# Altium schematic sheet Monitait_V2.SchDoc
size 889 x 508 mm
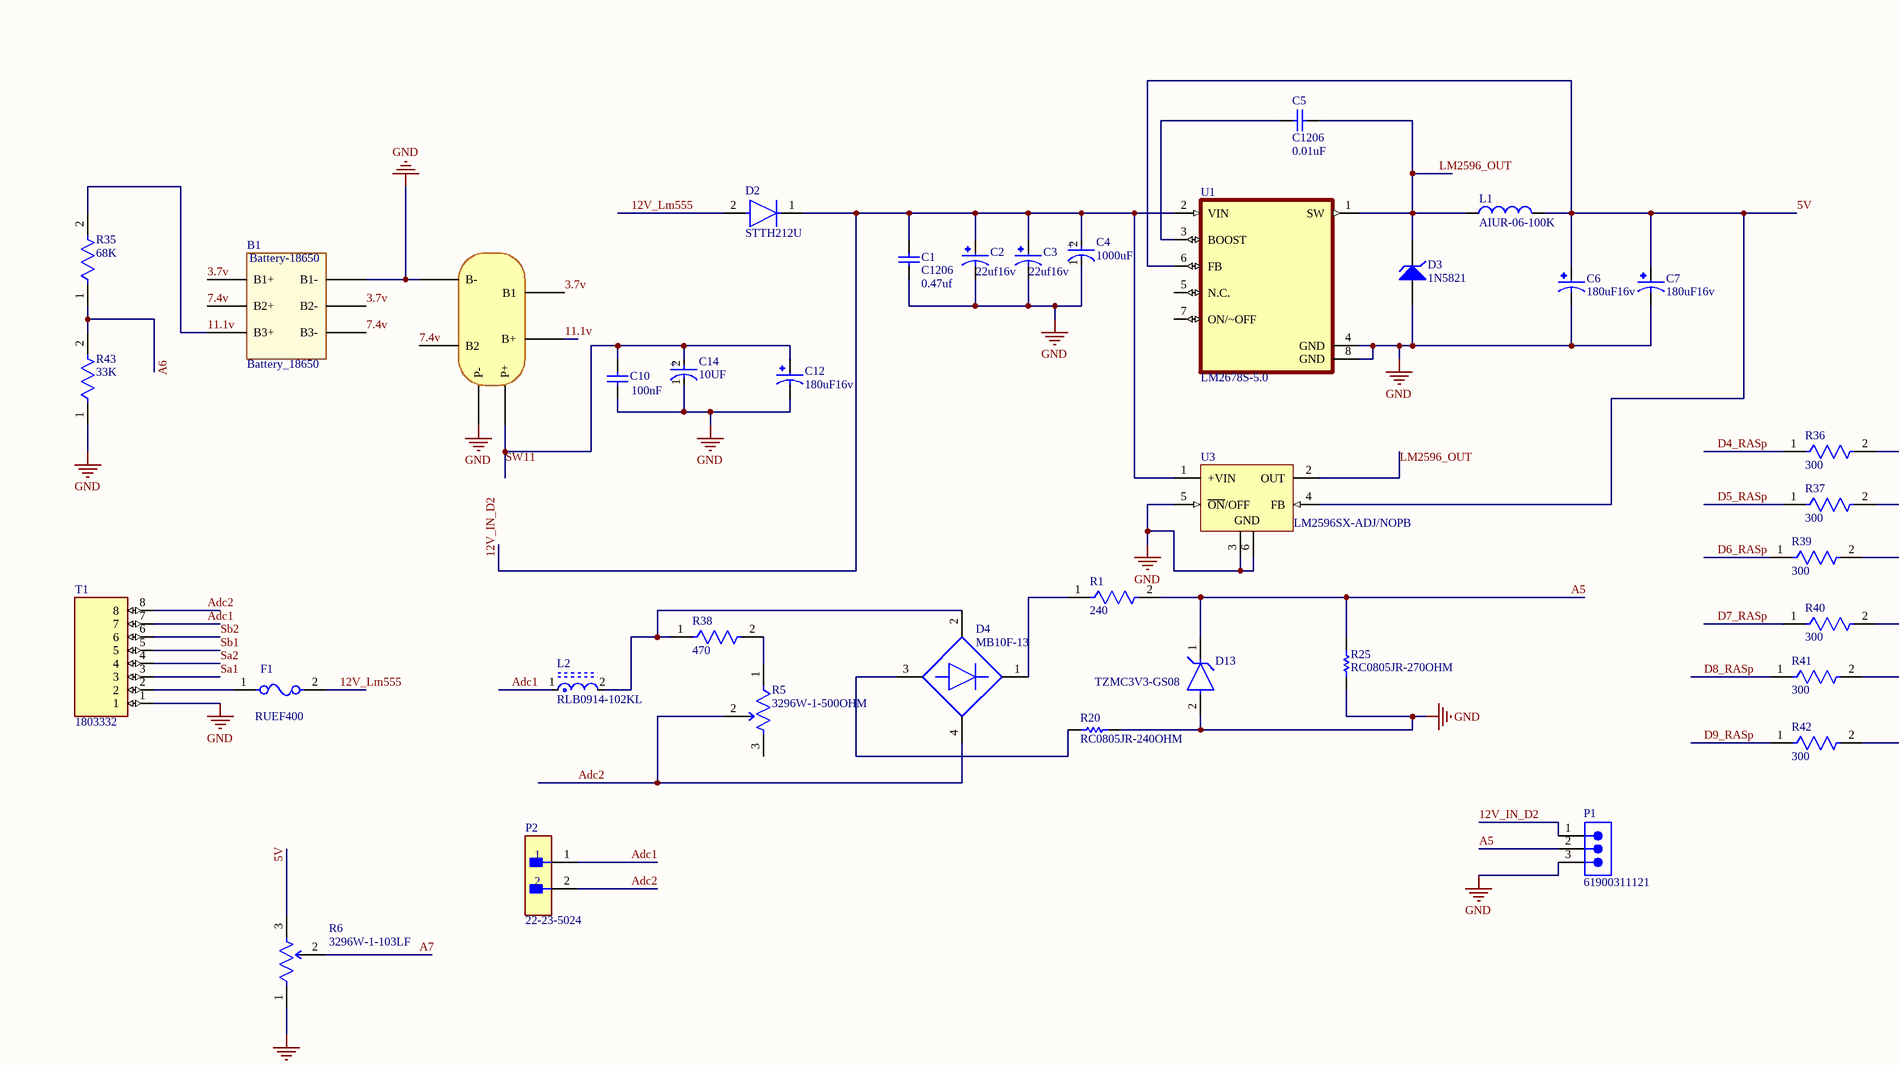
[diagram p0: Monitait_V2.SchDoc, top left]
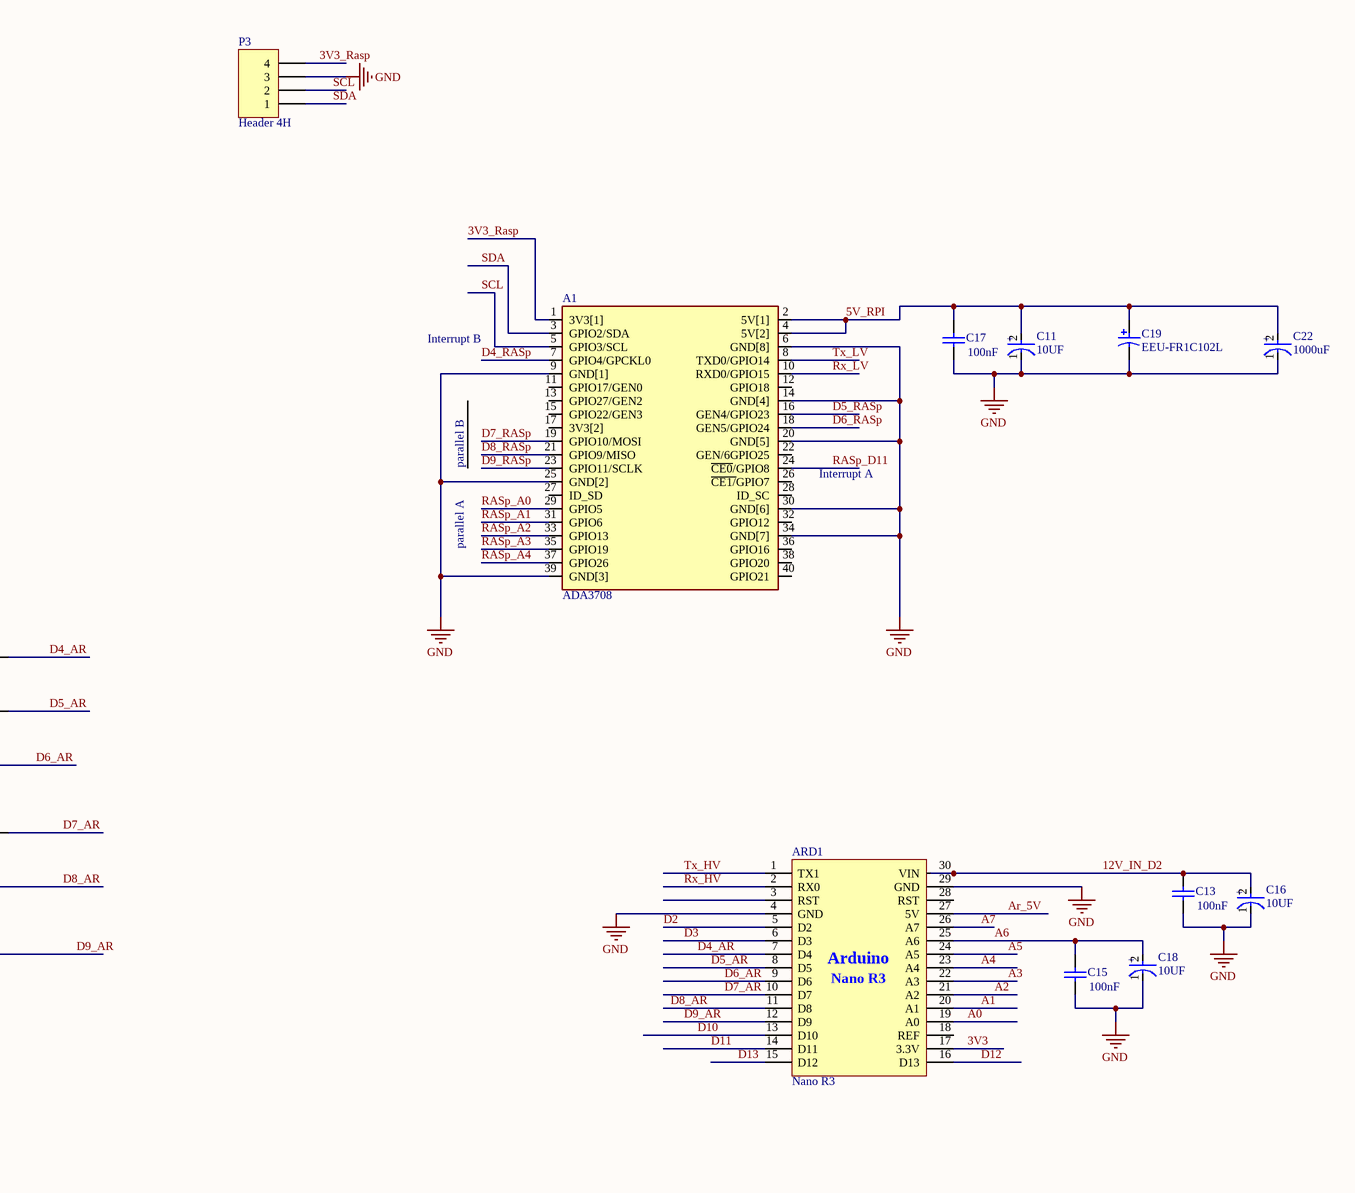
[diagram p1: Monitait_V2.SchDoc, top middle]
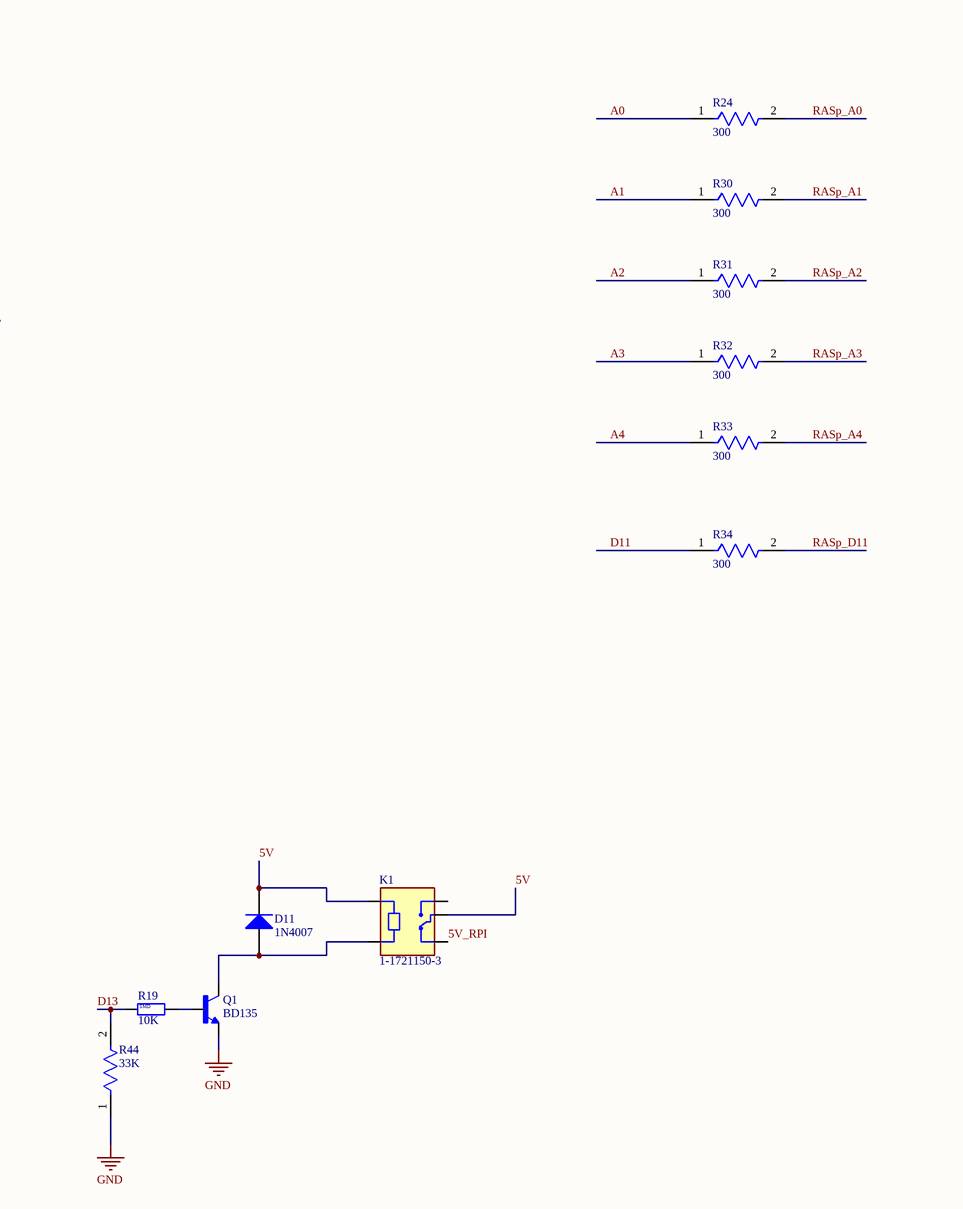
[diagram p2: Monitait_V2.SchDoc, top right]
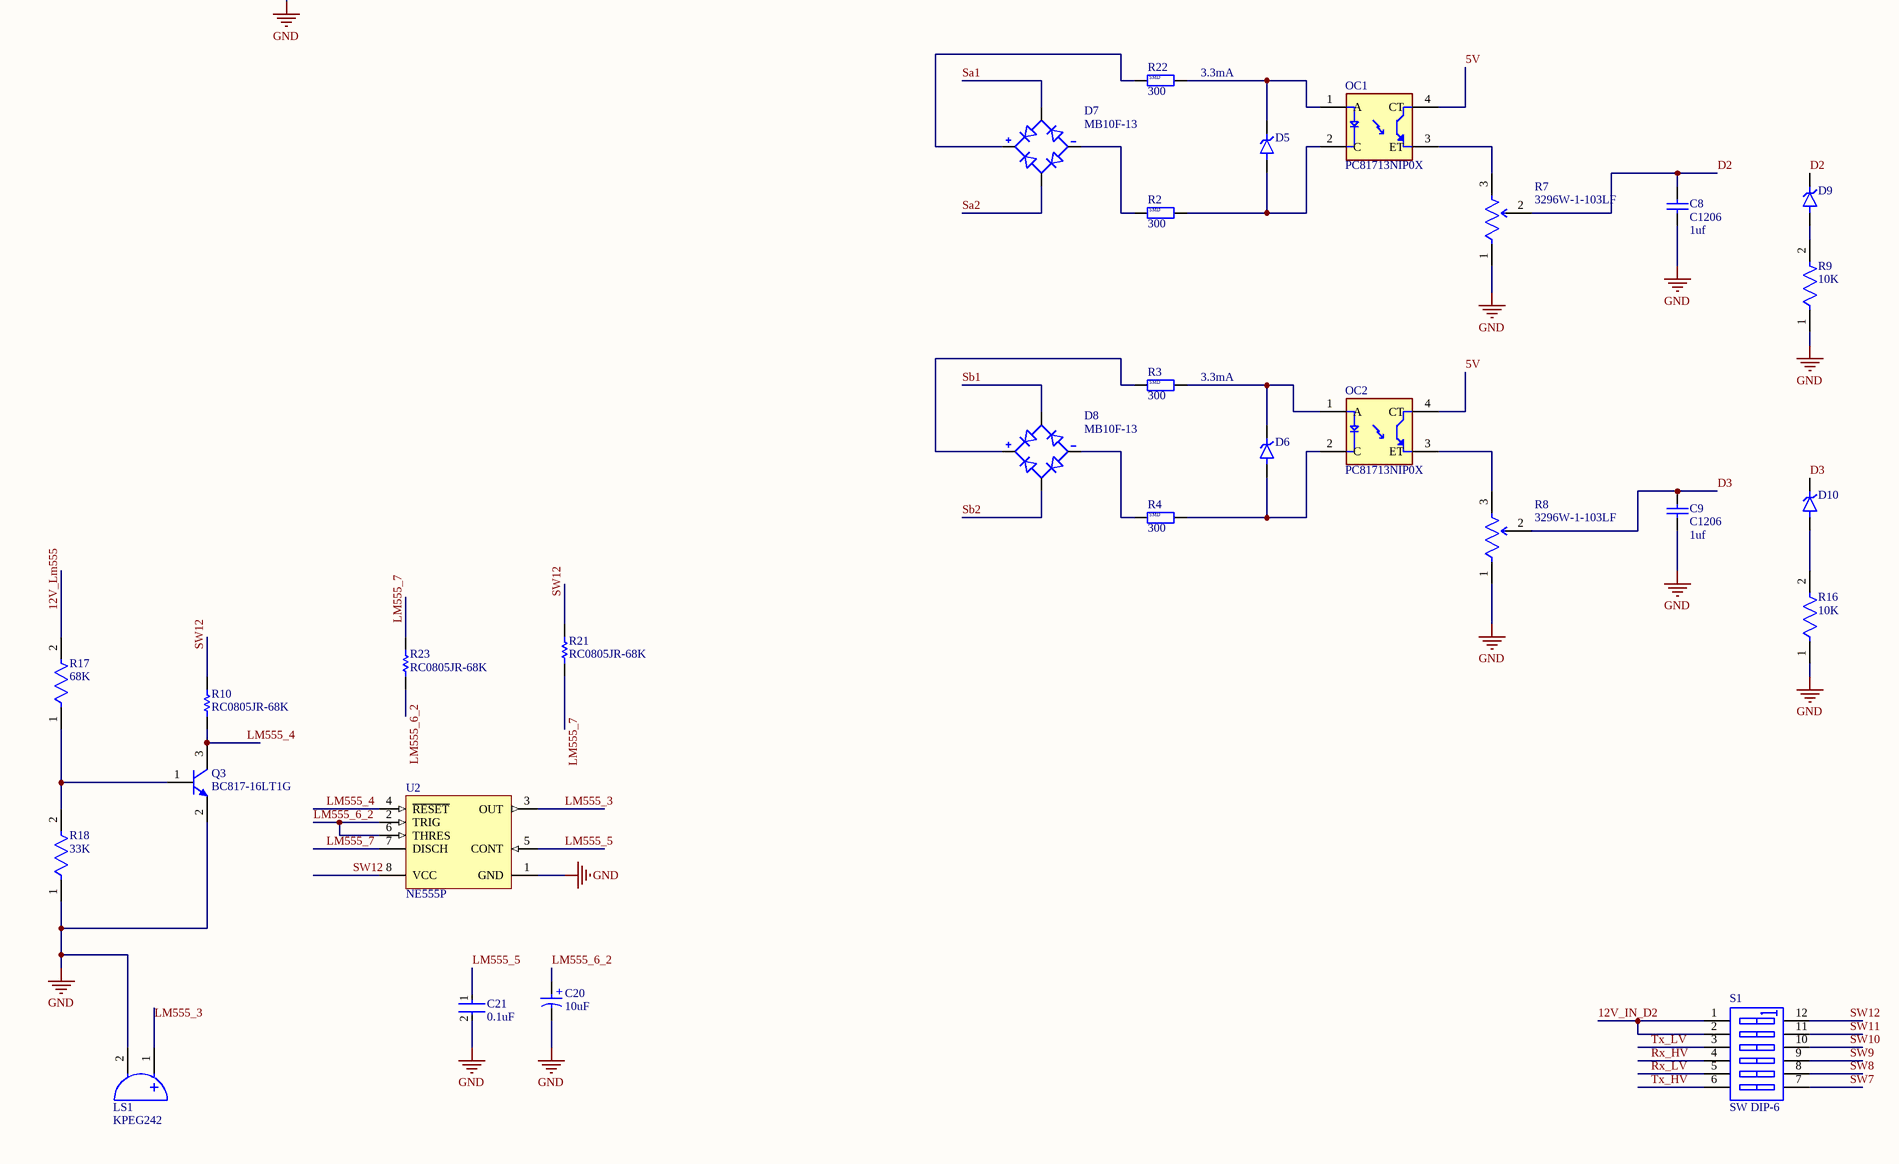
[diagram p3: Monitait_V2.SchDoc, bottom left]
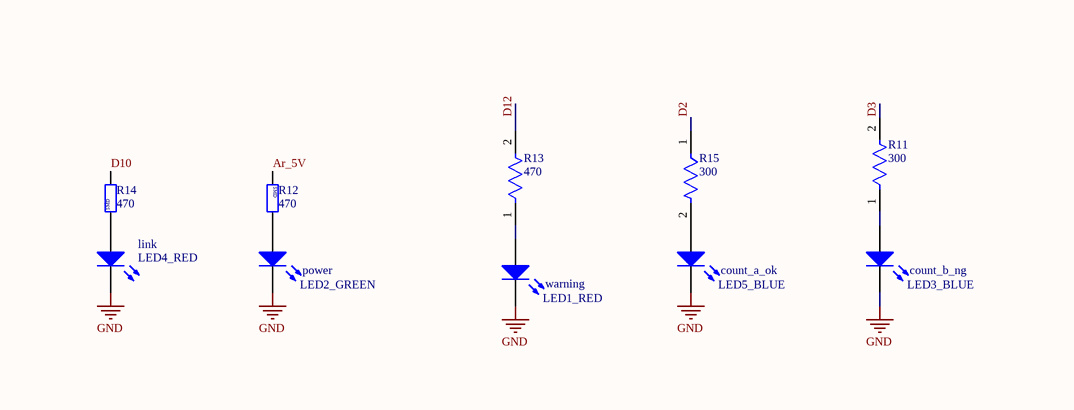
[diagram p4: Monitait_V2.SchDoc, bottom middle]
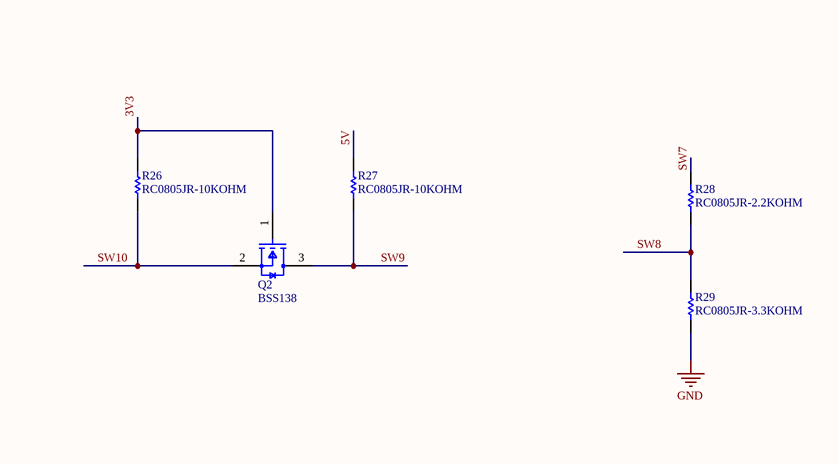
[diagram p5: Monitait_V2.SchDoc, bottom right]

## Parts
A1  ADA3708  [ADA3708_RPI-ZERO]
ARD1  Nano R3  [Arduino_Nano_R3]
B1  Battery_18650  [Battery-18650]
C1  C1206  value 0.47uf  [1206]
C2  22uf16v  [CAPPRD500W45D500H500]
C3  22uf16v  [CAPPRD500W45D500H500]
C4  1000uF  [FP-RAD-TH-D_8_0_5-L_15_1-MFG]
C5  C1206  value 0.01uF  [1206]
C6  180uF16v  [CAPPRD250W50D630H1650]
C7  180uF16v  [CAPPRD250W50D630H1650]
C8  C1206  value 1uf  [1206]
C9  C1206  value 1uf  [1206]
C10  value 100nF  [1206]  (hidden comment: C1206)
C11  10UF  [FP-T491B106K020AT-MFG]
C12  180uF16v  [CAPPRD250W50D630H1650]
C13  value 100nF  [1206]  (hidden comment: C1206)
C14  10UF  [FP-T491B106K020AT-MFG]
C15  value 100nF  [1206]  (hidden comment: C1206)
C16  10UF  [FP-T491B106K020AT-MFG]
C17  value 100nF  [1206]  (hidden comment: C1206)
C18  10UF  [FP-T491B106K020AT-MFG]
C19  EEU-FR1C102L  [PNSC-FR-A-8X20-2_V]
C20  10uF  [WCAP-ATLL_D8H11.5]
C21  0.1uF  [FP-K15H5-MFG]
C22  1000uF  [FP-RAD-TH-D_8_0_5-L_15_1-MFG]
count_a_ok  LED5_BLUE  [LED-3mm]
count_b_ng  LED3_BLUE  [LED-3mm]
D2  STTH212U  [FP-SMB-MFG]
D3  1N5821  [299-02]
D4  MB10F-13  [FP-MBF-MFG]
D5  LLZ5248B  [DIOMELF3515N]  (value not drawn)
D6  LLZ5248B  [DIOMELF3515N]  (value not drawn)
D7  MB10F-13  [DIOB_MB10F-13]
D8  MB10F-13  [DIOB_MB10F-13]
D9  LLZ5248B  [DIOMELF3515N]  (value not drawn)
D10  LLZ5248B  [DIOMELF3515N]  (value not drawn)
D11  1N4007  [My_DO-41]
D13  TZMC3V3-GS08  [FP-6_560-5005_01-4-MFG]
F1  RUEF400  [FP-RUEF400-MFG]
K1  1-1721150-3  [RELAY_1-1721150-3]
L1  AIUR-06-100K  [ABRA-AIUR-06-2_V]
L2  RLB0914-102KL  [FP-RLB0914-MFG]
link  LED4_RED  [LED-3mm]
LS1  KPEG242  [KINGS-KPEG242-2]
M1  FL10A  [FL10A]  (value not drawn)
OC1  PC81713NIP0X  [SOT254P1025X400-4N]
OC2  PC81713NIP0X  [SOT254P1025X400-4N]
P1  61900311121  [61900311121]
P2  22-23-5024  [FP-22-23-5024-MFG]
P3  Header 4H  [HDR1X4H]
power  LED2_GREEN  [LED-3mm]
Q1  BD135  [TO229P780X300X2000-3]
Q2  BSS138  [FP-318-08-IPC_B]
Q3  BC817-16LT1G  [ONSC-SOT-23-3-318-08_V]
R1  240  [FP-CRCW1206-e3-IPC_C]
R2  300  [1206]
R3  300  [1206]
R4  300  [1206]
R5  3296W-1-500OHM  [FP-3296W-MFG]
R6  3296W-1-103LF  [FP-3296W-MFG]
R7  3296W-1-103LF  [FP-3296W-MFG]
R8  3296W-1-103LF  [FP-3296W-MFG]
R9  10K  [FP-CRCW1206-e3-IPC_C]
R10  RC0805JR-68K  [RESC2013X60X35ML10T20]
R11  300  [FP-CRCW1206-e3-IPC_C]
R12  470  [1206]
R13  470  [FP-CRCW1206-e3-IPC_C]
R14  470  [1206]
R15  300  [FP-CRCW1206-e3-IPC_C]
R16  10K  [FP-CRCW1206-e3-IPC_C]
R17  68K  [FP-CRCW1206-e3-IPC_C]
R18  33K  [FP-CRCW1206-e3-IPC_C]
R19  10K  [1206]
R20  RC0805JR-240OHM  [RESC2013X60X35ML10T20]
R21  RC0805JR-68K  [RESC2013X60X35ML10T20]
R22  300  [1206]
R23  RC0805JR-68K  [RESC2013X60X35ML10T20]
R24  300  [FP-CRCW1206-e3-IPC_B]
R25  RC0805JR-270OHM  [RESC2013X60X35ML10T20]
R26  RC0805JR-10KOHM  [RESC2013X60X35ML10T20]
R27  RC0805JR-10KOHM  [RESC2013X60X35ML10T20]
R28  RC0805JR-2.2KOHM  [RESC2013X60X35ML10T20]
R29  RC0805JR-3.3KOHM  [RESC2013X60X35ML10T20]
R30  300  [FP-CRCW1206-e3-IPC_B]
R31  300  [FP-CRCW1206-e3-IPC_B]
R32  300  [FP-CRCW1206-e3-IPC_B]
R33  300  [FP-CRCW1206-e3-IPC_B]
R34  300  [FP-CRCW1206-e3-IPC_B]
R35  68K  [FP-CRCW1206-e3-IPC_C]
R36  300  [FP-CRCW1206-e3-IPC_C]
R37  300  [FP-CRCW1206-e3-IPC_C]
R38  470  [FP-CRCW1206-e3-IPC_C]
R39  300  [FP-CRCW1206-e3-IPC_C]
R40  300  [FP-CRCW1206-e3-IPC_C]
R41  300  [FP-CRCW1206-e3-IPC_C]
R42  300  [FP-CRCW1206-e3-IPC_C]
R43  33K  [FP-CRCW1206-e3-IPC_C]
R44  33K  [FP-CRCW1206-e3-IPC_C]
S1  SW DIP-6  [DIP-12/SW]
T1  1803332  [SHDRRA8W83P0X381_1X8_3187X920X]
U1  LM2678S-5.0  [TO127P1435X464-8N]
U2  NE555P  [P0008A]
U3  LM2596SX-ADJ/NOPB  [KTT0005B_L]
warning  LED1_RED  [LED-3mm]

## Nets
GND: A1.6(GND[8]) A1.9(GND[1]) A1.14(GND[4]) A1.20(GND[5]) A1.25(GND[2]) A1.30(GND[6]) A1.34(GND[7]) A1.39(GND[3]) ARD1.4(GND) ARD1.29(GND) B1.B1- C1.1 C2.N C3.N C4.1(C) C6.N C7.N C8.1 C9.1 C10.1 C11.1(C) C12.N C13.1 C14.1(C) C15.1 C16.1(C) C17.1 C18.1(C) C19.2 C20.2(N) C21.2 C22.1(C) count_a_ok.2(K) count_b_ng.2(K) D3.1(A) D13.2(A) link.2(K) LS1.2 M1.B- M1.P- P1.3 P3.3 power.2(K) Q1.1(E) Q3.2(E) R6.1(CCW) R7.1(CCW) R8.1(CCW) R9.1 R16.1 R18.1 R20.2 R25.2 R29.1 R43.1 R44.1 T1.1 U1.4(GND) U1.8(GND) U2.1(GND) U3.3(GND) U3.5(~{ON}/OFF) U3.6(GND) warning.2(K)
3.7v: B1.B1+ B1.B2- M1.B1
3V3: ARD1.17(3.3V) Q2.1(G) R26.2
3V3_Rasp: A1.1(3V3[1]) P3.4
5V: C6.P C7.P D11.K K1.A1 K1.COM L1.2 OC1.4(CT) OC2.4(CT) R6.3(CW) R27.2 U1.6(FB) U3.4(FB)
5V_RPI: A1.2(5V[1]) A1.4(5V[2]) C11.2(A) C17.2 C19.1 C22.2(A) K1.NC
7.4v: B1.B2+ B1.B3- M1.B2
11.1v: B1.B3+ M1.B+ R35.2
12V_IN_D2: ARD1.30(VIN) C1.2 C2.P C3.P C4.2(A) C13.2 C16.2(A) D2.1(K) P1.1 S1.1(A1) S1.2(A2) U1.2(VIN) U3.1(+VIN)
12V_Lm555: D2.2(A) F1.2 R17.2
A0: ARD1.19(A0) R24.1
A1: ARD1.20(A1) R30.1
A2: ARD1.21(A2) R31.1
A3: ARD1.22(A3) R32.1
A4: ARD1.23(A4) R33.1
A5: ARD1.24(A5) D13.1(C) P1.2 R1.2 R25.1
A6: ARD1.25(A6) C15.2 C18.2(A) R35.1 R43.2
A7: ARD1.26(A7) R6.2(WIPER)
Adc1: L2.1 P2.1 T1.7
Adc2: D4.4(2_~) P2.2 R5.2(WIPER) T1.8
Ar_5V: ARD1.27(5V) R12.1
D2: ARD1.5(D2) C8.2 D9.C(K) R7.2(WIPER) R15.1
D3: ARD1.6(D3) C9.2 D10.C(K) R8.2(WIPER) R11.2
D4_AR: ARD1.7(D4) R36.2
D4_RASp: A1.7(GPIO4/GPCKL0) R36.1
D5_AR: ARD1.8(D5) R37.2
D5_RASp: A1.16(GEN4/GPIO23) R37.1
D6_AR: ARD1.9(D6) R39.2
D6_RASp: A1.18(GEN5/GPIO24) R39.1
D7_AR: ARD1.10(D7) R40.2
D7_RASp: A1.19(GPIO10/MOSI) R40.1
D8_AR: ARD1.11(D8) R41.2
D8_RASp: A1.21(GPIO9/MISO) R41.1
D9_AR: ARD1.12(D9) R42.2
D9_RASp: A1.23(GPIO11/SCLK) R42.1
D10: ARD1.13(D10) R14.2
D11: ARD1.14(D11) R34.1
D12: ARD1.16(D13) R13.2
D13: ARD1.15(D12) R19.1 R44.2
LM555_3: LS1.1 U2.3(OUT)
LM555_4: Q3.3(C) R10.2 U2.4(~{RESET})
LM555_5: C21.1 U2.5(CONT)
LM555_6_2: C20.1(P) R23.2 U2.2(TRIG) U2.6(THRES)
LM555_7: R21.2 R23.1 U2.7(DISCH)
LM2596_OUT: C5.1 D3.2(K) L1.1 U1.1(SW) U3.2(OUT)
RASp_A0: A1.29(GPIO5) R24.2
RASp_A1: A1.31(GPIO6) R30.2
RASp_A2: A1.33(GPIO13) R31.2
RASp_A3: A1.35(GPIO19) R32.2
RASp_A4: A1.37(GPIO26) R33.2
RASp_D11: A1.24(~{CE0}/GPIO8) R34.2
Rx_HV: ARD1.2(RX0) S1.4(A4)
Rx_LV: A1.10(RXD0/GPIO15) S1.5(A5)
Sa1: D7.2(AC1) T1.3
Sa2: D7.4(AC2) T1.4
Sb1: D8.2(AC1) T1.5
Sb2: D8.4(AC2) T1.6
SCL: A1.5(GPIO3/SCL) P3.2
SDA: A1.3(GPIO2/SDA) P3.1
SW7: R28.2 S1.7(B6)
SW8: R28.1 R29.2 S1.8(B5)
SW9: Q2.3(D) R27.1 S1.9(B4)
SW10: Q2.2(S) R26.1 S1.10(B3)
SW11: C10.2 C12.P C14.2(A) M1.P+ S1.11(B2)
SW12: R10.1 R21.1 S1.12(B1) U2.8(VCC)
Tx_HV: ARD1.1(TX1) S1.6(A6)
Tx_LV: A1.8(TXD0/GPIO14) S1.3(A3)
NetC5_2: C5.2 U1.3(BOOST)
Netcount_a_ok_1: count_a_ok.1(A) R15.2
Netcount_b_ng_1: count_b_ng.1(A) R11.1
NetD4_1: D4.1(+) R1.1
NetD4_2: D4.2(1_~) L2.2 R38.1
NetD4_3: D4.3(-) R20.1
NetD5_A: D5.A OC1.2(C) R2.2
NetD5_C: D5.C(K) OC1.1(A) R22.2
NetD6_A: D6.A OC2.2(C) R4.2
NetD6_C: D6.C(K) OC2.1(A) R3.2
NetD7_1: D7.1(POS) R22.1
NetD7_3: D7.3(NEG) R2.1
NetD8_1: D8.1(POS) R3.1
NetD8_3: D8.3(NEG) R4.1
NetD9_A: D9.A R9.2
NetD10_A: D10.A R16.2
NetD11_A: D11.A K1.A2 Q1.2(C)
NetF1_1: F1.1 T1.2
Netlink_1: link.1(A) R14.1
NetOC1_3: OC1.3(ET) R7.3(CW)
NetOC2_3: OC2.3(ET) R8.3(CW)
Netpower_1: power.1(A) R12.2
NetQ1_3: Q1.3(B) R19.2
NetQ3_1: Q3.1(B) R17.1 R18.2
NetR5_1: R5.1(CCW) R38.2
NetR13_1: R13.1 warning.1(A)

Not connected (* = marked no-connect by the designer): A1 11(GPIO17/GEN0) 12(GPIO18) 13(GPIO27/GEN2) 15(GPIO22/GEN3) 17(3V3[2]) 22(GEN/6GPIO25) 26(~{CE1/}GPIO7) 27(ID_SD) 28(ID_SC) 32(GPIO12) 36(GPIO16) 38(GPIO20) 40(GPIO21); ARD1 3(RST) 18(REF) 28(RST); K1 NO; R5 3(CW); U1 5(N.C.) 7(ON/~OFF)

## Notes on the sheet
- Interrupt B
- parallel B
- (near A1) Interrupt A
- parallel A
- (near R22) 3.3mA
- (near R3) 3.3mA
- (in symbol Arduino Nano R3) Arduino
- (in symbol Battery_18650) Battery-18650
- (in symbol CMP-2000-07191-2) +
- (in symbol CMP-03913-53914461-1) +
- (in symbol CMP-05427-001033-1) +
- (in symbol Resistor SMD) SMD

## Library data of the parts
A1 = ADA3708: Raspberry Pi Zero WH (Zero W with Headers); MP: ADA3708; Availability: Unavailable; Package: None; Value: *; Price: None
ARD1 = Arduino Nano R3
C1 C5 C8-C10 C13 C15 C17 = C1206: Ceramic Chip Capacitor - Standard; Published: 17-Jul-2002; LatestRevisionDate: 19-Mar-2004; LatestRevisionNote: Silkscreen size reduced.; DatasheetDocument: Mar-2001; PackageDocument: Mar-2001; PackageReference: 1206; Publisher: Altium Limited; Code_JEITA: 1206; Code_IPC: 3216 [1206]; ComponentLink1Description: Manufacturer Link; ComponentLink1URL: http://www.kemet.com/; ComponentLink2Description: Datasheet; ComponentLink2URL: http://www.kemet.com/kemet/web/homepage/kechome.nsf/vapubfilesname/F3102TA.pdf/$file/F3102TA.pdf
C2 C3 = ECEA1CKS220B: CAP ALUM 22UF 20% 16V RADIAL; MF: Panasonic; MP: ECE-A1CKS220B; Package: RADIAL-2 Panasonic; Price: None; Check_prices: https://www.snapeda.com/parts/ECE-A1CKS220B/Panasonic/view-part/2340841/?ref=eda; Value: *; SnapEDA_Link: https://www.snapeda.com/parts/ECE-A1CKS220B/Panasonic/view-part/2340841/?ref=snap; Availability: In Stock
C4 C22 = CMP-05427-001033-1: Aluminum Electrolytic Capacitors (Radial Lead Type) 1000uF ±20% 10V; Ripple Current: 1.24A; Impedance: 41mR; Capacitance: 1mF; Lead Diameter: 0.6mm; Lead/Base Style: Straight; Life (Hours): 8000Hour; Dissipation Factor: 0.19%; Min Operating Temperature: -40°C; Height - Seated (Max): 0.65inch; Packaging: Bulk; Lead Pitch: 3.5mm; Max Operating Temperature: 105°C; Ripple Current (AC): 1.24A; ESR (Equivalent Series Resistance): 41mR; Construction: RADIAL; Voltage Rating: 10V; Voltage: 10V; Mount: Through Hole; Radiation Hardening: No; Termination: Radial; RoHS Compliant: Yes; Length: 15mm; REACH SVHC: No SVHC; Tolerance: 20%; Case/Package: Radial; Contact Plating: Tin; Height: 15mm; Series: FR; Diameter: 8mm; Voltage Rating (DC): 10V; Package Quantity: 200; Number of Pins: 2
C6 C7 C12 = UPM1C181MED1TD: Cap Aluminum Lytic 180uF 16V 20% (6.3 X 15mm) Radial 2.5mm 285mA 2000h 105Â°C Ammo; MF: Nichicon; SnapEDA_Link: https://www.snapeda.com/parts/UPM1C181MED1TD/Nichicon/view-part/?ref=snap; Package: None; Value: *; MP: UPM1C181MED1TD; Check_prices: https://www.snapeda.com/parts/UPM1C181MED1TD/Nichicon/view-part/?ref=eda
C11 C14 C16 C18 = CMP-2000-07191-2: CAP TANT 10UF 10% 20V 1411; Polarity: Polar; Life (Hours): 2000Hour; Dissipation Factor: 6%; Leakage Current: 2uA; Dielectric Material: Tantalum; Ripple Current: 201mA; ESR (Equivalent Series Resistance): 2.1R; Weight: 0.002293oz; Max Operating Temperature: 125°C; Failure Rate: 0.001%; Tolerance: 10%; Case Code (Metric): 3528; Case Code (Imperial): 1411; Number of Pins: 2; Case/Package: 1411; Width: 2.8mm; Height: 1.9mm; Voltage Rating: 20V; Voltage: 20V; Lead Free: Lead Free; Features: General Purpose; Radiation Hardening: No; Min Operating Temperature: -55°C; Length: 3.5mm; Mount: Surface Mount; Depth: 2.8mm; Voltage Rating (DC): 20V; Termination: SMD/SMT; Package Quantity: 1; Capacitance: 10uF; Packaging: Tape and Reel; RoHS Compliant: Yes; REACH SVHC: No SVHC; Height - Seated (Max): 0.083inch
C19 = CMP-0744-00002-1: Aluminum Electrolytic Capacitor, 1000 uF +/- 20%, 16 V, -40 to 105 degC, 2-Pin THD, Dia 8 mm, Body Length 22 mm, RoHS; Manufacturer: Panasonic; Rated Voltage: 16 V; Resistance: 0.03 Ohm; Tolerance: +/- 20%; Rated Ripple Current: 1560 mA; Capacitance: 1000 uF; ComponentLink2URL: http://www.panasonic.com/industrial/includes/pdf/EEU-FR_DataSheet.pdf; DatasheetVersion: Apr-10; Temperature Range: -40 to 105 degC; ComponentLink1Description: Manufacturer URL; ComponentLink1URL: http://www.panasonic.com/industrial/electronic-components/; PartNumber: EEU-FR1C102L; PackageDescription: 2-Pin Radial Lead, Dia 8 mm, Body Length 22 mm, Pin Spacing 3.5 mm; PackageReference: FR-A-8X20-2; Mounting Technology: Through Hole; RoHS: TRUE; ComponentLink2Description: Datasheet
C20 = CMP-03913-53914461-1: 860160574013 WCAP-ATLL Aluminum Electrolytic Capacitors; Pitch: 3.5mm; Ripple Current: 414mA; Voltage Rating (DC): 35V; Tolerance: 20%; Life (Hours): 7000hours; Capacitance: 100µF; Material: Aluminium; Leakage Current: 35µA; Length: 11.5mm; Case/Package: Radial; Min Operating Temperature: -55°C; Max Operating Temperature: 105°C; REACH SVHC: Unknown; NexarPartId: 53914461; Height: 11.5mm; RoHS: Non-Compliant; Diameter: 8mm; Voltage Rating: 35V; Lead Pitch: 3.5mm
C21 = CMP-02417-000048-1: CAP CER 0.1UF 50V X7R RADIAL; Capacitance: 100nF; Tolerance: 10%; Lead/Base Style: Formed Leads; Lead Length: 30mm; Lead Diameter: 0.5mm; Radiation Hardening: No; Lead Pitch: 5mm; Voltage: 50V; Mount: Through Hole; Package Quantity: 5000; Series: K; Case/Package: Dipped; Min Operating Temperature: -55°C; Depth: 2.5mm; Height - Seated (Max): 0.1inch; Voltage Rating (DC): 50V; Packaging: Bulk; RoHS Compliant: Yes; Construction: RADIAL; Thickness: 2.6mm; Max Operating Temperature: 125°C; Voltage Rating: 50V; Diameter: 500um; Dielectric: X7R; Width: 2.5mm; Length: 4mm; Weight: 0.005644oz; Termination: Radial; Height: 4mm
count_a_ok count_b_ng link power warning = LED 3mm: Typical LED; Designer: Seyed Mohsen Ghasemian; Published: 02/04/2012; PackageReference: LED; Publisher: www.picpars.com; PackageDescription: LED; 2 Leads
D2 = CMP-12188-000008-1: DIODE GEN PURP 1.2KV 2A SMB; Manufacturer: STMicroelectronics; Max Junction Temp: +175°C; Max Repetitive Reverse Voltage: 1200V; Peak Reverse Current: 10uA; Standoff Height: 0.05mm; Max Surge Forward Current: 40A; ComponentLink2URL: https://www.st.com/resource/en/datasheet/stth212.pdf; Device Class L2: Diodes; Digikey Description: DIODE GEN PURP 1.2KV 2A SMB; Mouser Description: Rectifiers high voltage diode; Device Class L1: Discrete Semiconductors; Temperature Range High: +175°C; Manufacturer Part Number: STTH212U; Package: SMB; Height: 2.65mm; ComponentLink2Description: Datasheet; Category: Diode; Device Class L3: Rectifier Diodes; Automotive: No; RoHS: TRUE; Octopart: https://octopart.com/stth212u-stmicroelectronics-658227; Forward Current: 2A; Temperature: to +175°C; Lead Free: Yes
D3 = 1N746A: 500 mW Hermetically Sealed Glass Silicon Zener Diode; Published: 29-Sep-2000; LatestRevisionDate: 17-Jul-2002; LatestRevisionNote: Re-released for DXP Platform.; PackageReference: 299-02; Publisher: Altium Limited; PackageDescription: Diode, Axial; Body 5.1 x 2.3 mm (LxDia. max), Lead Dia. 0.56 mm (max); Code_JEDEC: DO-204-AH; ComponentLink1Description: Manufacturer Link; ComponentLink1URL: http://www.onsemi.com/site/products/landing?taxonomyID=194
D4 = CMP-12791-000022-1: BRIDGE RECT 1PHASE 1KV 800MA MBF; Manufacturer: Diodes Incorporated; Max Surge Forward Current: 30A; Max Repetitive Reverse Voltage: 1000V; Peak Reverse Current: 0.2uA; Capacitance: 8pF; Value: 8pF; Max Junction Temp: +150°C; Forward Current: 0.5A; ComponentLink2Description: Datasheet; Category: Diode; RoHS: TRUE; Package: MBF; Device Class L2: Diodes; Lead Free: Yes; Manufacturer Part Number: MB10F-13; Temperature Range Low: -55°C; Footprint Url: https://www.diodes.com/assets/Package-Files/MBF.pdf; Octopart: https://octopart.com/mb10f-13-diodes+inc.-82160020; Automotive: No; Device Class L3: Rectifier Diodes; Digikey Description: BRIDGE RECT 1PHASE 1KV 800MA MBF; ComponentLink2URL: https://www.diodes.com/assets/Datasheets/MB10F.pdf; Reverse Voltage: 1000V; Temperature Range High: +150°C; Temperature: -55°C to +150°C; Mouser Description: Diode Rectifier Bridge Single 1000V 0.8A 4-Pin Case MBF T/R; Height: 1.8mm; Device Class L1: Discrete Semiconductors
D5 D6 D9 D10 = LLZ5248B: Zener Diode Single 18V 5% 21Ohm 500mW 2-Pin Mini-MELF; MF: Taiwan Semiconductor; Price: None; Package: MINI MELF-2-2 Taiwan Semiconductor; MP: LLZ5248B; Availability: Not in stock; SnapEDA_Link: https://www.snapeda.com/parts/LLZ5248B/Taiwan+Semiconductor/view-part/?ref=snap; Check_prices: https://www.snapeda.com/parts/LLZ5248B/Taiwan+Semiconductor/view-part/?ref=eda; Value: *
D7 D8 = MB10F-13: Bridge Rectifier Single Phase Standard 1 kV Surface Mount MBF; MF: Diodes Inc.; Check_prices: https://www.snapeda.com/parts/MB10F-13/Diodes+Inc./view-part/?ref=eda; Value: *; Availability: In Stock; MP: MB10F-13; Price: None; Package: SMD-4 Diodes Inc.; SnapEDA_Link: https://www.snapeda.com/parts/MB10F-13/Diodes+Inc./view-part/?ref=snap; Purchase-URL: https://pricing.snapeda.com/search/part/MB10F-13/?ref=eda
D11 = 1N4007: 1 Amp Diode
D13 = CMP-02541-000008-1: DIODE ZENER 3.3V 500MW SOD80; Manufacturer: Vishay; Reverse Voltage: 1V; Max Junction Temp: +175°C; Max Zener Voltage: 3.5V; Zener Impedance: 90Ω; Max Reverse Leakage Current: 2uA; Forward Current: 200mA; Automotive Grade: Grade 0; ComponentLink2Description: Datasheet; Category: Diode; ComponentLink2URL: http://www.vishay.com/docs/84122/tzm.pdf; Lead Free: Yes; Device Class L2: Diodes; Digikey Description: DIODE ZENER 3.3V 500MW SOD80; Mouser Description: Zener Diodes 3.3 Volt 0.5 Watt; Device Class L1: Discrete Semiconductors; Package: 6.560-5005.01-4; Device Class L3: Zener Diodes; Manufacturer Part Number: TZMC3V3-GS08; Temperature Range High: +175°C; Height: 1.6mm; Automotive: Yes; Temperature: to +175°C; RoHS: TRUE; Nom Zener Voltage: 3.3V; Octopart: https://octopart.com/tzmc3v3-gs08-vishay-55388698; Power Dissipation: 500mW
F1 = CMP-08606-000051-1: PTC RESET FUSE 30V 4A RADIAL; Manufacturer: Littelfuse; Current Rating: 100A; Resistance: 0.01-0.05Ω; Trip Time: 12.7s; Trip Current: 8A; Value: 0.01-0.05Ω; Hold Current: 4A; Ambient Temperature Range Low: -40°C; Temperature Range Low: -40°C; Temperature Range High: +85°C; Lead Free: Yes; ComponentLink2URL: https://www.littelfuse.com/~/media/electronics/datasheets/resettable_ptcs/littelfuse_ptc_radial_leaded_ruef_datasheet.pdf.pdf; Temperature: -40°C to +85°C; Device Class L1: Circuit Protection; Voltage Rating: 30V; Ambient Temperature Range High: +85°C; Digikey Description: PTC RESET FUSE 30V 4A RADIAL; RoHS: TRUE; Automotive: No; Category: Fuse; Mouser Description: PTC Resettable Fuse 4A(hold) 8A(trip) 30V 100A 2.5W 12.7s 0.01Ohm Radial 14 X 3 X 19.3mm Bag; Device Class L2: PTC Resettable Fuses; Package: RUEF400; Height: 19.3mm; Device Class L3: unset; ComponentLink2Description: Datasheet; Octopart: https://octopart.com/ruef400-littelfuse-74215791; Manufacturer Part Number: RUEF400
K1 = 1-1721150-3: ORWH Series Miniature PCB Relay with Wash Tight 1-Pole 1-Form C 1 CO 12 VDC 400 Ohm 360 mW Silver Zinc Oxide; Package: None; Availability: Unavailable; Value: *; MP: 1-1721150-3; Price: None
L1 = CMP-2000-05038-1: Fixed Inductor, 10 uH, +/- 10%, -40 to 85 degC, 2-Pin THD, RoHS, Bulk; Manufacturer: ABRACON; Case Length: 18mm; Type: ThruHolePowerInductor; Inductance: 10uH; Case Diameter: 12.7mm; Maximum DC Resistance: 0.031Ohms; Core Material: Ferrite; Shielding: Unshielded; Maximum DC Current: 8.8A; Lead Diameter: 0.81mm; Package / Case: 12.7mmx18mm; Packaging: Bulk; Series: AIUR-06; Package Reference: AIUR-06; RoHS: Details; Tolerance: 10%; Product: PowerInductors; Manufacturer URL: http://www.abracon.com/; Package Description: 2-Pin Through Hole Device, Dia 12.7 mm, Pitch 7.37 mm; Factory Pack Quantity: 250; Product Category: FixedInductors; Datasheet URL: http://www.abracon.com/Magnetics/radial/AIUR05-06.pdf; Brand: ABRACON; Operating Temperature Range: -40Cto+125C; Lead Spacing: 7.37mm; Termination Style: Radial; Datasheet Version: Rev. 1.1, 08/2004
L2 = CMP-07248-000082-1: FIXED IND 1MH 420MA 2.1 OHM TH; Lead/Base Style: Radial; Shielding: Unshielded; DC Resistance (DCR): 2.1R; Max DC Current: 300mA; Core Material: Ferrite; Inductance Tolerance: 10%; Test Frequency: 252kHz; Material: Steel; Self Resonant Frequency: 1.3MHz; Q Factor: 40; Lead Diameter: 0.65mm; Termination: Radial; Resistor Type: Wirewound; Min Operating Temperature: -40°C; Mount: Through Hole; Radiation Hardening: No; Military Standard: Not; RMS Current (Irms): 300mA; Height - Seated (Max): 0.512inch; Series: RLB; Length: 12mm; Inductance: 1mH; Resistance: 2.1R; Lead Pitch: 5mm; Number of Pins: 2; Height: 12mm; REACH SVHC: No SVHC; Packaging: Bulk; Package Quantity: 200; Max Operating Temperature: 105°C; Tolerance: 10%; Diameter: 8.7mm; Case/Package: Radial; Body Material: Ferrite; Orientation: Vertical; DC Current: 300mA; Current Rating: 300mA; RoHS Compliant: Yes
LS1 = CMP-2000-06518-1: Piezo Indicator, 4100 Hz, 3 to 16 V, -20 to 70 degC, 2-Pin THD, RoHS; PartNumber: KPE-242; Manufacturer: KingstateElectronicsCorp.; Frequency Range: 3600to4600Hz; Maximum Supply Current: 7mA; Typical Operating Supply Voltage: 12Vdc; Product Height: 7.6mm; Current - Max: 7A; Tone Mode: Continuous; Product Diameter: 13.7mm; Minimum Sound Pressure: 70dBA; Maximum Resonant Frequency: 4600Hz; Type: Indicator; Datasheet URL: https://datasheet.ciiva.com/11776/0900766b8068f3a2-11776713.pdf; Mounting: ThroughHole; Technology: Piezo; Operating Temperature: -20to70°C; Category: AudioIndicatorsandAlerts; Termination Method: Pin; Manufacturer URL: http://www.kingstate.com.tw/index.php/en/; Package Description: 2-Pin Through Hole Device, Body Dia 13.7 mm, Pitch 7.62 mm; Datasheet Version: 01/2006; Package Reference: KPEG242; Mounting Technology: ThroughHole
OC1 OC2 = PC81713NIP0X: Optoisolator Transistor Output 5000Vrms 1 Channel 4-SMD; MF: SHARP/Socle Technology; MP: PC81713NIP0X; Purchase-URL: https://pricing.snapeda.com/search/part/PC81713NIP0X/?ref=eda; SnapEDA_Link: https://www.snapeda.com/parts/PC81713NIP0X/SHARP%252FSocle+Technology/view-part/?ref=snap; Package: SMD-4 SOCLE Technology; Availability: In Stock; Check_prices: https://www.snapeda.com/parts/PC81713NIP0X/SHARP%252FSocle+Technology/view-part/?ref=eda; Value: *; Price: None
P1 = CMP-1502-00585-2: NexarPartId: 18818222; Current Rating: 3A; Voltage Rating: 250V; Number of Positions: 3; Insulation Resistance: 1GΩ; Gender: Male; Pitch: 2.54mm; Connector Type: Male Pin; Contact Resistance: 20mΩ; Termination: Through Hole; Width: 7.66mm; Contact Plating: Tin; Orientation: Vertical; Mount: Through Hole; Contact Gender: Male; Max Operating Temperature: 105°C; Length: 7.62mm; Number of Rows: 1; Height: 12.5mm; Lead Pitch: 2.54mm; Housing Material: Nylon; Color: Beige; Contact Material: Copper; Fastening Type: Friction; Min Operating Temperature: -40°C; Number of Contacts: 3; Number of Pins: 3; Flammability Rating: UL94 V-0; Contact Mating Length: 7.493mm; RoHS: Compliant; REACH SVHC: Unknown; Packaging: Bulk; Operating Supply Voltage: 250V
P2 = CMP-04776-000057-1: CONN HEADER VERT 2POS 2.54MM; Manufacturer: Molex; Current Rating: 4A; Conn Orientation: Straight; Number Of Contacts: 2; Voltage Rating: 500V; Conn Gender: Male; Number Of Rows: 1; Height: 8.43mm; Automotive: No; RoHS: TRUE; Device Class L2: Headers and Wire Housings; Contact Material: Tin,Nickel; Manufacturer Part Number: 22-23-5024; Category: Conn; Digikey Description: CONN HEADER VERT 2POS 2.54MM; ComponentLink2Description: Datasheet; ComponentLink2URL: https://www.molex.com/pdm_docs/sd/022235024_sd.pdf; Device Class L1: Connectors; Package: 22-23-5024; Octopart: https://octopart.com/22-23-5024-molex-6792956; Pitch: 2.54mm; Mouser Description: Headers & Wire Housings KK 100 Hdr Assy FLk Assy FLk 02 ckt Tin; Device Class L3: unset; Lead Free: Yes
P3 = Header 4H: Header, 4-Pin, Right Angle; LatestRevisionDate: 17-Jul-2002; LatestRevisionNote: Re-released for DXP Platform.; Publisher: Altium Limited
Q1 = BD135: TRANSISTOR, NPN, TO-126; Transistor Polarity:NPN; Collector Emitter Voltage V(br)ceo:45V; Power Dissipation Pd:12.5W; DC Collector Current:1A; DC Current Gain hFE:40; Transistor Case Style:TO-126; No. of Pins:3; SVHC:No SVHC (18-Jun-2012); Collector Emitter Voltage Vces:500mV; Continuous Collector Current Ic Max:1A; Current Ic Continuous a Max:1A; Current Ic hFE:150mA; Full Power Rating Temperature:25Â°C; Hfe Min:40; No. of Transistors:1; Package / Case:TO-126; Power Dissipation Pd:12.5W; Power Dissipation Ptot Max:12.5W; Termination Type:Through Hole; Voltage Vcbo:45V; MF: ON Semiconductor; Availability: In Stock; SnapEDA_Link: https://www.snapeda.com/parts/BD135/Onsemi/view-part/?ref=snap; Price: None; Check_prices: https://www.snapeda.com/parts/BD135/Onsemi/view-part/?ref=eda; Package: TO-225-3 ON Semiconductor; MP: BD135; Value: *; Purchase-URL: https://pricing.snapeda.com/search/part/BD135/?ref=eda
Q2 = CMP-07173-000101-1: MOSFET N-CH 50V 220MA SOT-23; Turn-Off Delay Time: 20ns; Element Configuration: Single; Rds On Max: 3.5R; Gate to Source Voltage (Vgs): 20V; Threshold Voltage: 1.3V; Number of Elements: 1; Power Dissipation: 360mW; Rise Time: 9ns; Turn-On Delay Time: 2.5ns; Input Capacitance: 27pF; On-State Resistance: 6R; Lead Free: Lead Free; Length: 2.92mm; Width: 1.3mm; Drain to Source Breakdown Voltage: 50V; Min Operating Temperature: -55°C; REACH SVHC: No SVHC; Packaging: Tape and Reel; Radiation Hardening: No; Height: 0.93mm; Drain to Source Voltage (Vdss): 50V; Current Rating: 220mA; Voltage Rating (DC): 50V; Weight: 0.03g; Continuous Drain Current (ID): 220mA; Number of Pins: 3; Nominal Vgs: 1.3V; Max Power Dissipation: 360mW; Fall Time: 9ns; Drain to Source Resistance: 3.5R; Contact Plating: Tin; Case/Package: SOT-23; Package Quantity: 1; Dual Supply Voltage: 50V; Mount: Surface Mount; Termination: SMD/SMT; Max Operating Temperature: 150°C
Q3 = CMP-1048-00736-1: General Purpose Transistor, NPN Silicon, 3-Pin SOT-23, Pb-Free, Tape and Reel; Manufacturer: On Semiconductor; IC Continuous (A): 0.5; fT Min (MHz): 100; PartNumber: BC817-16LT1G; Mounting Technology: Surface Mount; PackageVersion: Rev. AP, 11/2009; ComponentLink3Description: Package Specification; PackageReference: SOT-23-3-318-08; Packing: Tape and Reel; ComponentLink1URL: http://www.onsemi.com/; Polarity: NPN; RoHS: TRUE; ComponentLink2URL: http://www.onsemi.com/pub_link/Collateral/BC817-16LT1-D.PDF; ComponentLink3URL: http://www.onsemi.cn/pub_link/Collateral/318-08.PDF; ComponentLink2Description: Datasheet; PackageDescription: 3-Pin Small Outline Transistor, Body 2.92 x 1.3 mm, Pitch 0.95 mm; ComponentLink1Description: Manufacturer URL; DatasheetVersion: Rev. 12
R1 R9 R11 R13 R15-R18 R35-R44 = CMP-2003-04827-2: RES Thick Film, 118kΩ, 1%, 0.25W, 100ppm/°C, 1206; Resistance: 118kR; Max Power Dissipation: 250mW; Voltage Rating: 200V; Number of Pins: 2; Radiation Hardening: No; Tolerance: 1%; Case Code (Imperial): 1206; Lead Free: Lead Free; Depth: 1.6mm; Packaging: Tape and Reel; Features: Automotive AEC-Q200; Width: 0.063inch; Package Quantity: 10; Power Rating: 250mW; Length: 3.2mm; Composition: Thick Film; Contact Plating: Tin; Number of Terminations: 2; Temperature Coefficient: 100ppm/°C; Case/Package: 1206; Military Standard: Not; Case Code (Metric): 3216; Weight: 0.000353oz; Max Operating Temperature: 155°C; Voltage Rating (DC): 200V; Height: 0.024inch; Termination: SMD/SMT; Min Operating Temperature: -55°C
R2-R4 R12 R14 R19 R22 = Resistor SMD: Resistor; Published: 8-Jun-2000; LatestRevisionDate: 17-Jul-2002; LatestRevisionNote: Re-released for DXP Platform.; PackageReference: AXIAL-0.4; Publisher: Altium Limited; PackageDescription: Axial Device, Thru-Hole; 2 Leads; 0.4 in Pin Spacing
  R2-R4 R22: Value: 300
  R12 R14: Value: 470
  R19: Value: 10K
R5-R8 = CMP-1747-00001-8: TRIMMER 10K OHM 0.5W PC PIN TOP; Number of Turns: 25; Tolerance: 10%; Resistance: 10kR; Max Power Dissipation: 500mW; Temperature Coefficient: 100ppm/°C; Insulation Resistance: 1GR; Min Operating Temperature: -55°C; Resistor Type: Cermet; Series: 3296; Color: Blue; Mount: Through Hole; Taper: Linear; Radiation Hardening: No; RoHS Compliant: Yes; Width: 9.53mm; Resistance Tolerance: 10%; Contact Plating: Tin; Military Standard: Not; Package Quantity: 50; Weight: 0.03oz; Lead Free: Lead Free; Power Rating: 500mW; Termination: Pin; Technology: CERMET; Max Operating Temperature: 125°C; Packaging: Rail/Tube; Length: 9.53mm; Depth: 4.83mm; Height: 11.55mm; Reach SVHC Compliant: Yes
R10 R20 R21 R23 R25-R29 = CMP-2100-03673-1: Chip Resistor, 0 Ohm, Jumper, +/- 5%, 0.125 W, -55 to 155 degC, 0805 (2012 Metric), RoHS, Tape and Reel; Manufacturer: Yageo; Power Rating: 125mW; Resistance: 0mOhm; Voltage Rating (DC): 150V; Temperature Coefficient: 200ppm/degreesC; Height: 0.5mm; Depth: 1.25mm; Case Code (Imperial): 0805; Lead Free: LeadFree; Military Standard: Not; Package Description: 2-Pin Surface Mounted Device, Body 2 x 1.25 mm; Case Code (Metric): 2012; Composition: ThickFilm; Voltage Rating: 150V; Manufacturer URL: http://www.yageo.com/; Packaging: TapeandReel; Package Reference: 0805; REACH SVHC: Unknown; Tolerance: 5%; Case/Package: 0805; Max Operating Temperature: 155degC; Number of Pins: 2; Min Operating Temperature: -55degC; RoHSCompliant: true; Length: 2mm; Datasheet URL: http://www.yageo.com/NewPortal/yageodocoutput?fileName=/pdf/R-Chip/PYu-RC_Group_51_RoHS_L_5.pdf; Termination: SMD/SMT; Radiation Hardening: No; Width: 1.25mm; Contact Plating: Tin; Datasheet Version: Rev. 5, 10/2016
R24 R30-R34 = CMP-2003-04801-2: RES Thick Film, 100Ω, 1%, 0.25W, 100ppm/°C, 1206; Voltage Rating (DC): 200V; Resistance: 100R; Power Rating: 250mW; Case Code (Metric): 3216; Radiation Hardening: No; Height: 0.55mm; Packaging: Tape and Reel; Depth: 1.6mm; Weight: 0.000353oz; Termination: SMD/SMT; Lead Free: Lead Free; Min Operating Temperature: -55°C; Contact Plating: Tin; Max Operating Temperature: 155°C; Case Code (Imperial): 1206; Military Standard: Not; Width: 1.6mm; Number of Pins: 2; Voltage Rating: 200V; Composition: Thick Film; Package Quantity: 5000; Tolerance: 1%; Case/Package: 1206; Mount: Surface Mount; Length: 3.2mm; Temperature Coefficient: 100ppm/°C
S1 = SW DIP-6: DIP Switch, 6 Position, SPST; Published: 24-Mar-1999; LatestRevisionDate: 17-Jul-2002; LatestRevisionNote: Re-released for DXP Platform.; PackageReference: DIP-12/SW; Publisher: Altium Limited; PackageDescription: DIP Switch; 12 Leads
T1 = 1803332: 8 Position Terminal Block Header, Male Pins, Shrouded (4 Side) 0.150 (3.81mm) 90Â°, Right Angle - Through Hole; MF: Phoenix Contact; Package: None; Price: None; Check_prices: https://www.snapeda.com/parts/1803332/Phoenix+Contact/view-part/?ref=eda; Value: *; SnapEDA_Link: https://www.snapeda.com/parts/1803332/Phoenix+Contact/view-part/?ref=snap; MP: 1803332; Availability: In Stock; Purchase-URL: https://pricing.snapeda.com/search?q=1803332&ref=eda
U1 = LM2678S-5.0: 8V to 40V, 5A SIMPLE SWITCHER buck converter with high efficiency 7-DDPAK/TO-263 -40 to 125; MF: Texas Instruments; Purchase-URL: https://pricing.snapeda.com/search/part/LM2678S-5.0/?ref=eda; Value: *; MP: LM2678S-5.0; Package: TO-263-7 Texas Instruments; Price: None; SnapEDA_Link: https://www.snapeda.com/parts/LM2678S-5.0/Texas%20Instruments/view-part/15037/?ref=snap; Availability: Warning
U2 = CMP-2000-04954-1: Precision Timer, 4.5 to 16 V, 0 to 70 degC, 8-Pin DIP, Pb-Free, Tube; Manufacturer: TexasInstruments; Maximum High Level Output Current: -200mA; Number of Internal Timers: 1; Operating Supply Voltage: 5; Maximum Low Level Output Current: 200mA; Rad Hard: No; Packaging: Rail/Tube; Manufacturer URL: http://www.ti.com/; Package Reference: P8; Package Description: 8-Pin Double In-line Package, Body 9.59 x 6.35 mm, Pitch 2.54 mm; Package URL: http://www.ti.com/lit/ml/mpdi001b/mpdi001b.pdf; Type: Standard; Datasheet URL: http://www.ti.com/general/docs/lit/getliterature.tsp?genericPartNumber=NE555&fileType=pdf; Category: Timer; Package: 8PDIP; Datasheet Version: Rev. I, 09/2014
U3 = CMP-2000-06545-1: Simple Switcher(R) Power Converter 150 kHz Step-Down Voltage Regulator, 3 A, 4.5 to 40 V, -40 to 125 degC, 5-Pin TO-263 (KTT), Green (RoHS & no Sb/Br), Tape and Reel; PartNumber: LM2596; Manufacturer: Texas Instruments; Package Version: 4200577-4/G, 01/2013; Primary Input Voltage: 40V; No. of Outputs: 1; No. of Pins: 5; SVHC: NoSVHC(19-Dec-2012); Output Voltage: 37V; Output Current: 3A; Datasheet Version: Rev. C, 04/2013; Package Reference: KTT5; MSL: MSL3-168hours; Number of Outputs: 1; Operating Temperature Min: -40°C; Operating Temperature Range: -40°Cto+125°C; Manufacturer URL: http://www.ti.com/; Package URL: http://www.ti.com/litv/pdf/mpsf007e; Voltage Regulator Case Style: TO-263; Operating Temperature Max: 125°C; Package Description: 5-Pin Plastic Flange Mount, Body 10.16 x 8.925 mm, Pitch 1.7 mm; Datasheet URL: http://www.ti.com/lit/ds/symlink/lm2596.pdf; Mounting Technology: SurfaceMount